# Altium schematic sheet SuperScampSchematic.SchDoc
size A
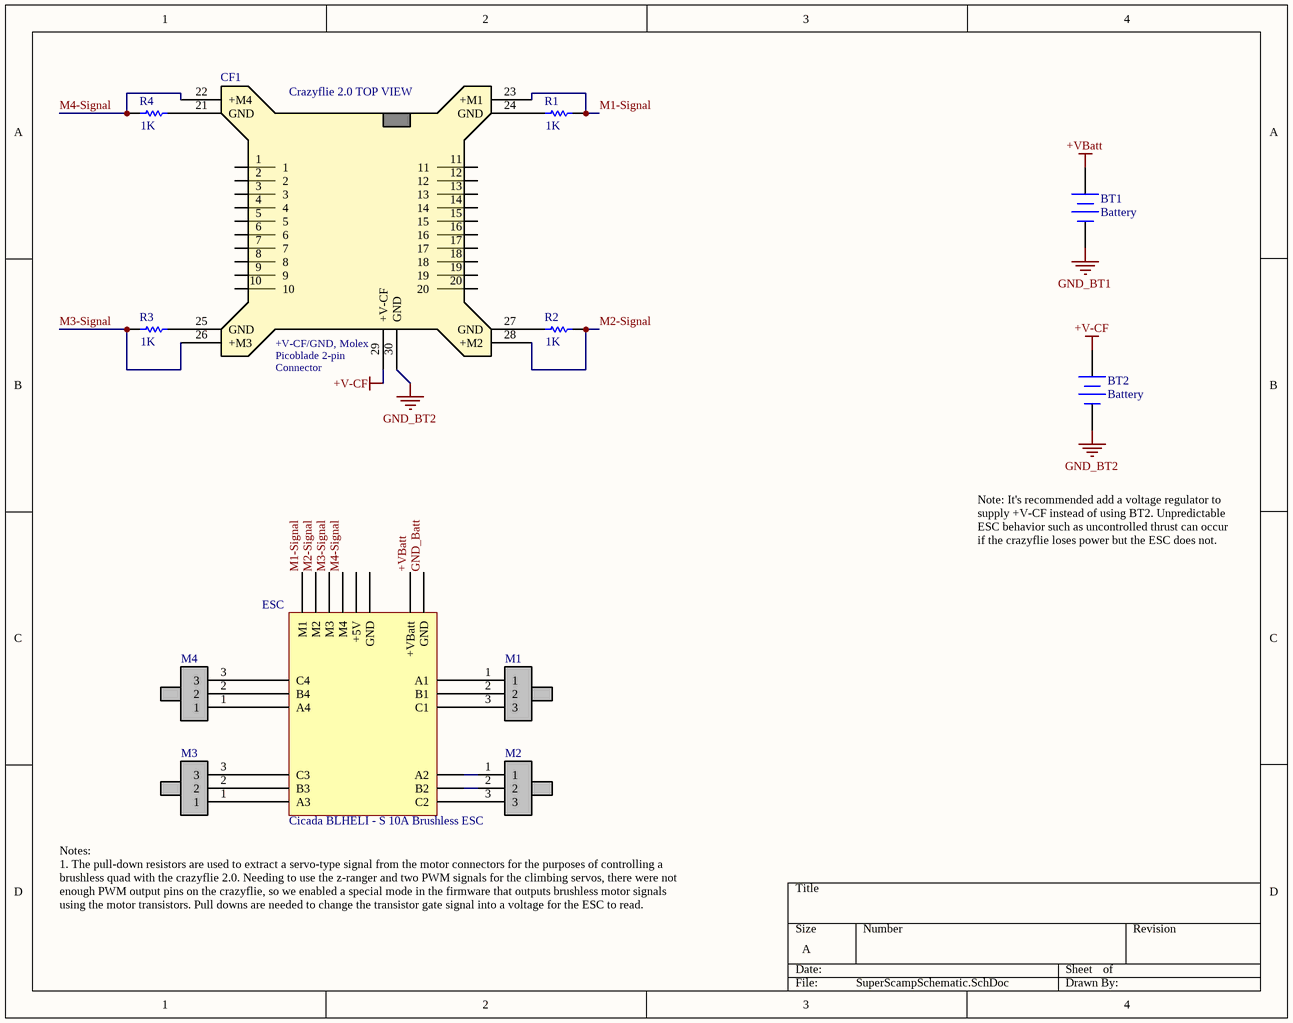
[diagram p0: SuperScampSchematic.SchDoc]

## Parts
BT1  Battery  [BAT-2]
BT2  Battery  [BAT-2]
CF1  Crazyflie 2.0  (value not drawn)
ESC  Cicada BLHELI - S 10A Brushless ESC
M1  M?  (value not drawn)
M2  M?  (value not drawn)
M3  M?  (value not drawn)
M4  M?  (value not drawn)
R1  value 1K  [AXIAL-0.3]  (hidden comment: Res1)
R2  value 1K  [AXIAL-0.3]  (hidden comment: Res1)
R3  value 1K  [AXIAL-0.3]  (hidden comment: Res1)
R4  value 1K  [AXIAL-0.3]  (hidden comment: Res1)

## Nets
+V-CF: BT2.1(+) CF1.29(+V-CF)
+VBatt: BT1.1(+) ESC.18(GND)
GND_BT1: BT1.2(-)
GND_BT2: BT2.2(-) CF1.30(GND)
GND_Batt: ESC.19(GND)
M1-Signal: CF1.23(+M1) ESC.13(M1) R1.2
M2-Signal: CF1.28(+M2) ESC.14(M2) R2.2
M3-Signal: CF1.26(+M3) ESC.15(M3) R3.1
M4-Signal: CF1.22(+M4) ESC.16(M4) R4.1
NetCF1_21: CF1.21(GND) R4.2
NetCF1_24: CF1.24(GND) R1.1
NetCF1_25: CF1.25(GND) R3.2
NetCF1_27: CF1.27(GND) R2.1
NetESC_4: ESC.4(A2) M2.1
NetESC_5: ESC.5(B2) M2.2
NetESC_7: ESC.7(A3) M3.1
NetESC_8: ESC.8(B3) M3.2
NetESC_9: ESC.9(C3) M3.3
NetESC_10: ESC.10(A4) M4.1
NetESC_11: ESC.11(B4) M4.2
NetESC_12: ESC.12(C4) M4.3

Not connected (* = marked no-connect by the designer): CF1 1 2 3 4 5 6 7 8 9 10 11 12 13 14 15 16 17 18 19 20; ESC 1(A1) 2(B1) 3(C1) 6(C2) 17(+5V); M1 1 2 3; M2 3

## Notes on the sheet
- Note: It's recommended add a voltage regulator to supply +V-CF instead of using BT2. Unpredictable ESC behavior such as uncontrolled thrust can occur if the crazyflie loses power but the ESC does not.
- Notes:
  1. The pull-down resistors are used to extract a servo-type signal from the motor connectors for the purposes of controlling a brushless quad with the crazyflie 2.0. Needing to use the z-ranger and two PWM signals for the climbing servos, there were not enough PWM output pins on the crazyflie, so we enabled a special mode in the firmware that outputs brushless motor signals using the motor transistors. Pull downs are needed to change the transistor gate signal into a voltage for the ESC to read.
- (in symbol Crazyflie 2.0) Crazyflie 2.0 TOP VIEW; +V-CF/GND, Molex Picoblade 2-pin Connector /

## Library data of the parts
BT1 BT2 = Battery: Multicell Battery; Published: 24-Mar-1999; LatestRevisionDate: 17-Jul-2002; LatestRevisionNote: Re-released for DXP Platform.; PackageReference: BAT-2; Publisher: Altium Limited; PackageDescription: Battery; 2 Leads
M1-M4 = DYS BE1104
R1-R4 = Res1: Resistor; Published: 8-Jun-2000; LatestRevisionDate: 17-Jul-2002; LatestRevisionNote: Re-released for DXP Platform.; PackageReference: AXIAL-0.3; Publisher: Altium Limited; PackageDescription: Axial Device, Thru-Hole; 2 Leads; 0.3 in Pin Spacing